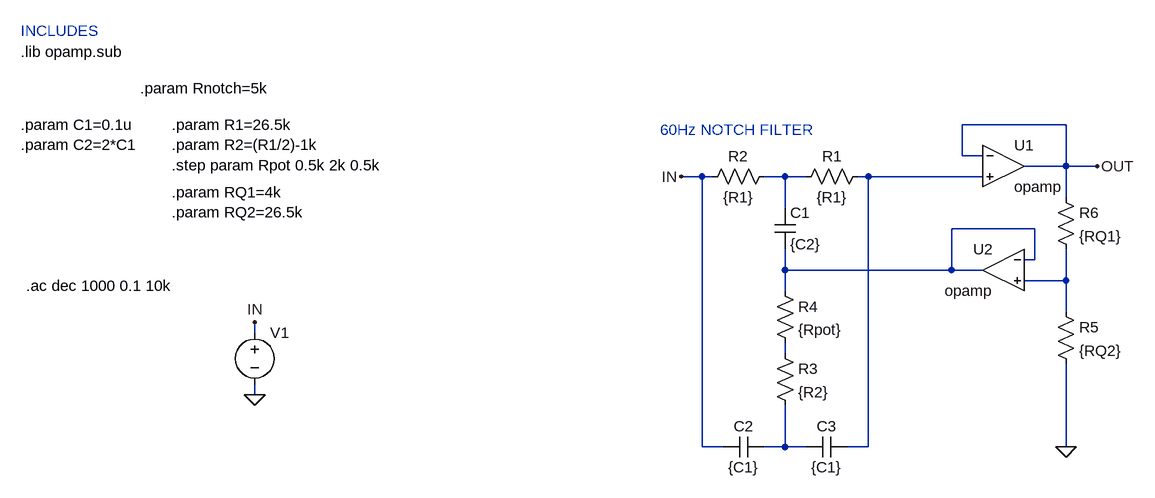
[diagram p0: schematic twint-filter.asc]
twint-filter.asc, the LTspice schematic file:
Version 4
SHEET 1 1092 680
WIRE 976 64 816 64
WIRE 816 112 816 64
WIRE 848 112 816 112
WIRE 976 128 976 64
WIRE 976 128 912 128
WIRE 1024 128 976 128
WIRE 416 144 384 144
WIRE 432 144 416 144
WIRE 544 144 512 144
WIRE 576 144 544 144
WIRE 672 144 656 144
WIRE 848 144 672 144
WIRE 976 176 976 128
WIRE 544 192 544 144
WIRE 928 224 800 224
WIRE 928 272 928 224
WIRE 928 272 912 272
WIRE 544 288 544 256
WIRE 800 288 800 224
WIRE 800 288 544 288
WIRE 848 288 800 288
WIRE 976 304 976 256
WIRE 976 304 912 304
WIRE 544 320 544 288
WIRE 976 352 976 304
WIRE -272 384 -272 368
WIRE 544 416 544 400
WIRE -272 480 -272 464
WIRE 416 560 416 144
WIRE 448 560 416 560
WIRE 544 560 544 496
WIRE 544 560 512 560
WIRE 576 560 544 560
WIRE 672 560 672 144
WIRE 672 560 640 560
WIRE 976 560 976 432
FLAG 976 560 0
FLAG -272 368 IN
FLAG -272 480 0
FLAG 384 144 IN
FLAG 1024 128 OUT
SYMBOL Opamps\\opamp 880 64 R0
SYMATTR InstName U1
SYMBOL res 672 128 R90
WINDOW 0 0 56 VBottom 2
WINDOW 3 32 56 VTop 2
SYMATTR InstName R1
SYMATTR Value {R1}
SYMBOL res 528 128 R90
WINDOW 0 0 56 VBottom 2
WINDOW 3 32 56 VTop 2
SYMATTR InstName R2
SYMATTR Value {R1}
SYMBOL cap 528 192 R0
SYMATTR InstName C1
SYMATTR Value {C2}
SYMBOL res 528 400 R0
SYMATTR InstName R3
SYMATTR Value {R2}
SYMBOL cap 512 544 R90
WINDOW 0 0 32 VBottom 2
WINDOW 3 32 32 VTop 2
SYMATTR InstName C2
SYMATTR Value {C1}
SYMBOL cap 640 544 R90
WINDOW 0 0 32 VBottom 2
WINDOW 3 32 32 VTop 2
SYMATTR InstName C3
SYMATTR Value {C1}
SYMBOL Opamps\\opamp 880 224 M0
SYMATTR InstName U2
SYMBOL voltage -272 368 R0
WINDOW 39 0 0 Left 0
SYMATTR InstName V1
SYMATTR Value ""
SYMATTR Value2 AC 1
SYMBOL res 528 304 R0
SYMATTR InstName R4
SYMATTR Value {Rpot}
SYMBOL res 960 336 R0
SYMATTR InstName R5
SYMATTR Value {RQ2}
SYMBOL res 960 160 R0
SYMATTR InstName R6
SYMATTR Value {RQ1}
TEXT -448 8 Left 2 !.param Rnotch=5k
TEXT 352 72 Left 2 ;60Hz NOTCH FILTER
TEXT -632 64 Left 2 !.param C1=0.1u\n.param C2=2*C1
TEXT -624 312 Left 2 !.ac dec 1000 0.1 10k
TEXT -400 64 Left 2 !.param R1=26.5k\n.param R2=(R1/2)-1k\n.step param Rpot 0.5k 2k 0.5k
TEXT -400 168 Left 2 !.param RQ1=4k\n.param RQ2=26.5k
TEXT -632 -48 Left 2 !.lib opamp.sub
TEXT -632 -80 Left 2 ;INCLUDES

The netlist it stands for:
* twint-filter.asc
XU1 OUT N002 OUT opamp Aol=100K GBW=10Meg  ; pins invin noninvin out
R1 N002 N001 {R1}
R2 N001 IN {R1}
C1 N001 N003 {C2}
R3 N005 N006 {R2}
C2 N006 IN {C1}
C3 N002 N006 {C1}
XU2 N003 N004 N003 opamp Aol=100K GBW=10Meg  ; pins invin noninvin out
V1 IN 0 AC 1
R4 N003 N005 {Rpot}
R5 N004 0 {RQ2}
R6 OUT N004 {RQ1}
.param Rnotch=5k
* 60Hz NOTCH FILTER
.param C1=0.1u
.param C2=2*C1
.ac dec 1000 0.1 10k
.param R1=26.5k
.param R2=(R1/2)-1k
.step param Rpot 0.5k 2k 0.5k
.param RQ1=4k
.param RQ2=26.5k
.lib opamp.sub
* INCLUDES
.backanno
.end